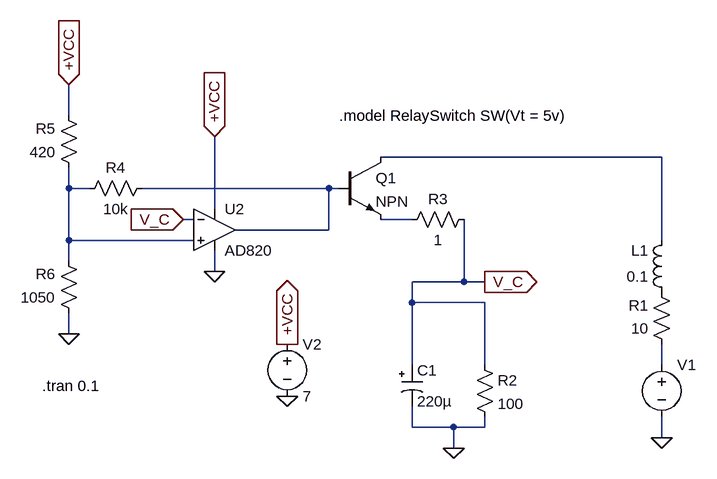
[diagram p0: schematic Circuito_RLC_Controlador_ONOFF_Histeresis.asc]
Circuito_RLC_Controlador_ONOFF_Histeresis.asc, the LTspice schematic file:
Version 4
SHEET 1 1508 680
WIRE 96 32 96 -16
WIRE 1008 96 576 96
WIRE 96 144 96 112
WIRE 128 144 96 144
WIRE 496 144 208 144
WIRE 512 144 496 144
WIRE 320 176 320 64
WIRE 288 192 272 192
WIRE 624 192 576 192
WIRE 496 208 496 144
WIRE 496 208 352 208
WIRE 96 224 96 144
WIRE 288 224 96 224
WIRE 1008 224 1008 96
WIRE 96 256 96 224
WIRE 320 272 320 240
WIRE 704 288 704 192
WIRE 704 288 624 288
WIRE 736 288 704 288
WIRE 624 320 624 288
WIRE 736 320 624 320
WIRE 96 368 96 336
WIRE 624 416 624 320
WIRE 736 416 736 320
WIRE 1008 416 1008 384
WIRE 624 512 624 480
WIRE 688 512 624 512
WIRE 736 512 736 496
WIRE 736 512 688 512
WIRE 1008 528 1008 496
WIRE 688 544 688 512
FLAG 272 192 V_C
IOPIN 272 192 In
FLAG 96 -16 +VCC
IOPIN 96 -16 In
FLAG 96 368 0
FLAG 320 272 0
FLAG 320 64 +VCC
IOPIN 320 64 In
FLAG 432 464 0
FLAG 432 384 +VCC
IOPIN 432 384 Out
FLAG 736 288 V_C
IOPIN 736 288 Out
FLAG 1008 528 0
FLAG 688 544 0
SYMBOL res 224 128 R90
WINDOW 0 0 56 VBottom 2
WINDOW 3 32 56 VTop 2
SYMATTR InstName R4
SYMATTR Value 10k
SYMBOL res 112 128 R180
WINDOW 0 36 76 Left 2
WINDOW 3 36 40 Left 2
SYMATTR InstName R5
SYMATTR Value 420
SYMBOL res 112 352 R180
WINDOW 0 36 76 Left 2
WINDOW 3 36 40 Left 2
SYMATTR InstName R6
SYMATTR Value 1050
SYMBOL voltage 432 368 R0
WINDOW 123 0 0 Left 0
WINDOW 39 0 0 Left 0
SYMATTR InstName V2
SYMATTR Value 7
SYMBOL polcap 608 416 R0
SYMATTR Value 220µ
SYMATTR InstName C1
SYMATTR Description Capacitor
SYMATTR Type cap
SYMATTR SpiceLine V=16 Irms=550m Rser=0.14 Lser=0
SYMBOL voltage 1008 400 R0
WINDOW 3 -352 -59 Invisible 2
WINDOW 123 0 0 Left 0
WINDOW 39 0 0 Left 0
SYMATTR Value PULSE(0 7 0 0.01 0 100 0 0)
SYMATTR InstName V1
SYMBOL res 720 400 R0
SYMATTR InstName R2
SYMATTR Value 100
SYMBOL res 1024 400 R180
WINDOW 0 36 76 Left 2
WINDOW 3 36 40 Left 2
SYMATTR InstName R1
SYMATTR Value 10
SYMBOL ind 1024 320 R180
WINDOW 0 36 80 Left 2
WINDOW 3 36 40 Left 2
SYMATTR InstName L1
SYMATTR Value 0.1
SYMBOL OpAmps\\AD820 320 144 R0
SYMATTR InstName U2
SYMBOL npn 512 96 R0
SYMATTR InstName Q1
SYMBOL res 720 176 R90
WINDOW 0 0 56 VBottom 2
WINDOW 3 32 56 VTop 2
SYMATTR InstName R3
SYMATTR Value 1
TEXT 144 448 Right 2 !.tran 0.1
TEXT 512 32 Left 2 !.model RelaySwitch SW(Vt = 5v)

The netlist it stands for:
* Circuito_RLC_Controlador_ONOFF_Histeresis.asc
R4 N003 N002 10k
R5 N002 +VCC 420
R6 0 N002 1050
V2 +VCC 0 7
C1 V_C 0 220µ V=16 Irms=550m Rser=0.14 Lser=0
V1 N005 0 PULSE(0 7 0 0.01 0 100 0 0)
R2 V_C 0 100
R1 N005 P001 10
L1 P001 N001 0.1
XU2 N002 V_C +VCC 0 N003 AD820  ; pins In+ In- V+ V- OUT
Q1 N001 N003 N004 0 NPN
R3 V_C N004 1
.model NPN NPN
.model PNP PNP
.lib standard.bjt
.tran 0.1
.model RelaySwitch SW(Vt = 5v)
.backanno
.end